# Altium schematic sheet LM61495RPHR_Buck.SchDoc
size A3; SheetNumber: 2; SheetTotal: 3
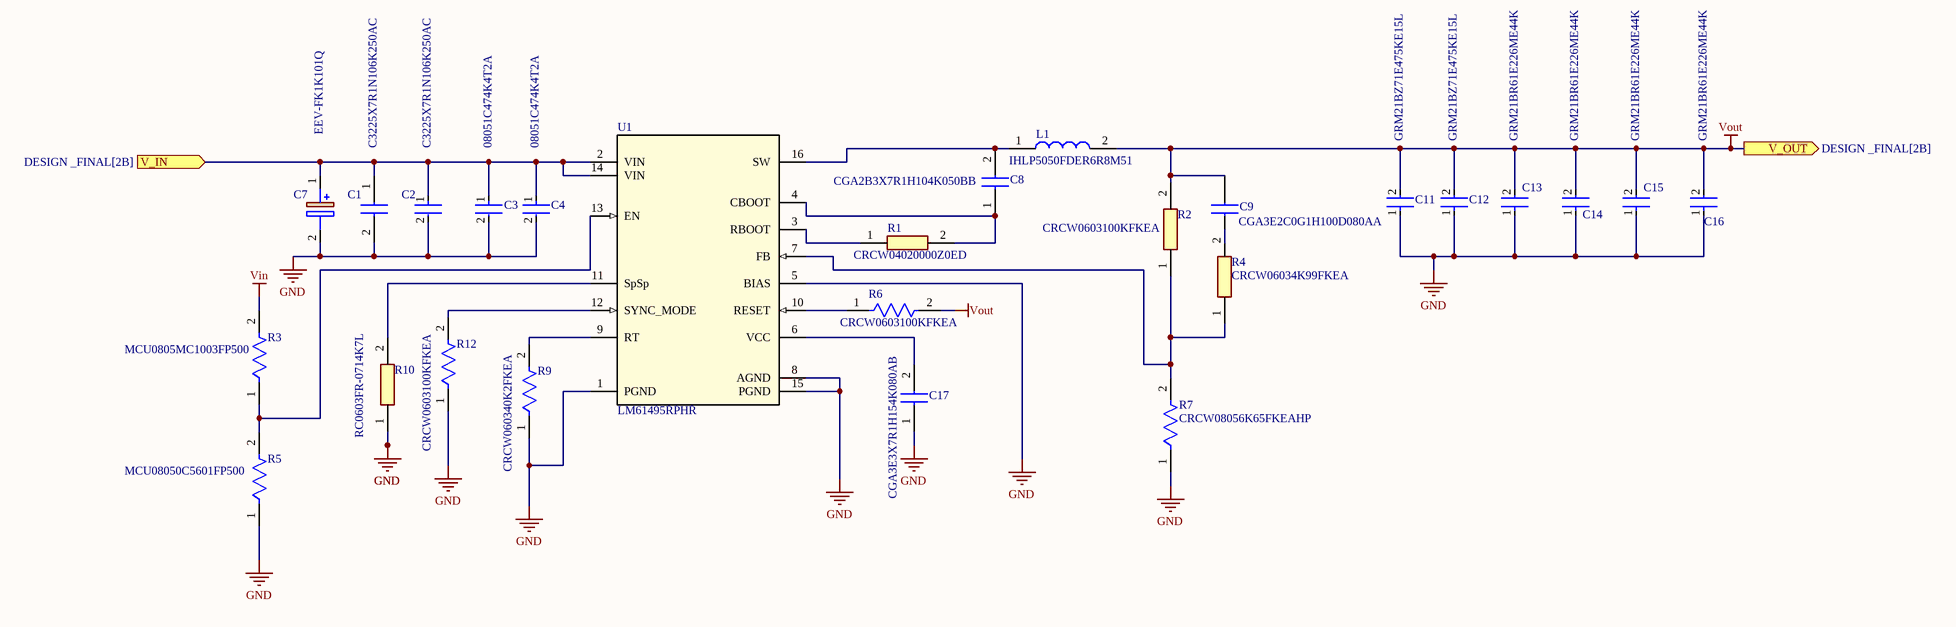
[diagram p0: LM61495RPHR_Buck.SchDoc]

## Parts
C1  C3225X7R1N106K250AC  [CAPC3225X230N]
C2  C3225X7R1N106K250AC  [FP-C3225-250-0_4-IPC_A]
C3  08051C474K4T2A  [FP-0805-L_2_01_0_2-W_1_25-MFG]
C4  08051C474K4T2A  [FP-0805-L_2_01_0_2-W_1_25-MFG]
C7  EEV-FK1K101Q  [EEEFK0J332AQ]
C8  CGA2B3X7R1H104K050BB  [CAPC1005X55N]
C9  CGA3E2C0G1H100D080AA  [CAPC1608X90N]
C11  GRM21BZ71E475KE15L  [FP-GRM21B-0_2-e0_2_0_7-MFG]
C12  GRM21BZ71E475KE15L  [FP-GRM21B-0_2-e0_2_0_7-MFG]
C13  GRM21BR61E226ME44K  [FP-GRM21B-0_2-e0_2_0_7-MFG]
C14  GRM21BR61E226ME44K  [FP-GRM21B-0_2-e0_2_0_7-MFG]
C15  GRM21BR61E226ME44K  [FP-GRM21B-0_2-e0_2_0_7-MFG]
C16  GRM21BR61E226ME44K  [FP-GRM21B-0_2-e0_2_0_7-MFG]
C17  CGA3E3X7R1H154K080AB  [GCM188]
L1  IHLP5050FDER6R8M51  [INDPM135129X640N]
R1  CRCW04020000Z0ED  [RESC1005X40N]
R2  CRCW0603100KFKEA  [RESC1608X50N]
R3  MCU0805MC1003FP500  [FP-MCU0805-IPC_B]
R4  CRCW06034K99FKEA  [RESC1608X50N]
R5  MCU08050C5601FP500  [FP-MCU0805-IPC_B]
R6  CRCW0603100KFKEA  [FP-CRCW0603C-e3-MFG]
R7  CRCW08056K65FKEAHP  [FP-CRCW0805-HPe3-IPC_C]
R9  CRCW060340K2FKEA  [FP-CRCW0603-e3-IPC_B]
R10  RC0603FR-0714K7L  [RESC1608X55N]
R12  CRCW0603100KFKEA  [FP-CRCW0603C-e3-MFG]
U1  LM61495RPHR  [RPH0016A]

## Ports
V_IN (in, see DESIGN _FINAL[2B]), V_OUT (out, see DESIGN _FINAL[2B])

## Nets
GND: C1.2 C2.2 C3.2 C4.2 C7.2(-) C11.1 C12.1 C13.1 C14.1 C15.1 C16.1 C17.1 R5.1 R7.1 R9.1 R10.1 R12.1 U1.1(PGND) U1.5(BIAS) U1.8(AGND) U1.15(PGND)
Vin: R3.2
Vout: C9.2 C11.2 C12.2 C13.2 C14.2 C15.2 C16.2 L1.2 R2.2 R6.2 ; port V_OUT
V_IN: C1.1 C2.1 C3.1 C4.1 C7.1(+) U1.2(VIN) U1.14(VIN) ; port V_IN
NetC8_1: C8.1 R1.2 U1.4(CBOOT)
NetC8_2: C8.2 L1.1 U1.16(SW)
NetC9_1: C9.1 R4.2
NetC17_2: C17.2 U1.6(VCC)
NetR1_1: R1.1 U1.3(RBOOT)
NetR2_1: R2.1 R4.1 R7.2 U1.7(FB)
NetR3_1: R3.1 R5.2 U1.13(EN)
NetR6_1: R6.1 U1.10(RESET)
NetR9_2: R9.2 U1.9(RT)
NetR10_2: R10.2 U1.11(SpSp)
NetR12_2: R12.2 U1.12(SYNC_MODE)

## Library data of the parts
C1 = C3225X7R1N106K250AC: Capacitor; Manufacturer_Name: TDK; Datasheet Link: https://product.tdk.com/info/en/catalog/datasheets/mlcc_commercial_midvoltage_en.pdf; Height: 2.3mm; Manufacturer_Part_Number: C3225X7R1N106K250AC; Mouser Part Number: 810-C3225X7R1N106K25; Mouser Price/Stock: https://www.mouser.co.uk/ProductDetail/TDK/C3225X7R1N106K250AC?qs=P1JMDcb91o5%2Fi%252BA2Vs0UoQ%3D%3D; Arrow Part Number: C3225X7R1N106K250AC; Arrow Price/Stock: https://www.arrow.com/en/products/c3225x7r1n106k250ac/tdk?region=nac
C2 = CMP-08246-003742-1: Multilayer Ceramic Capacitors 10uF ±10% 75V X7R SMD 1210; RoHS Compliant: Yes
C3 C4 = CMP-2007-04773-2: Automotive Ceramic Capacitor, 0805, 470nF, 10%, X7R, 15%, 100V; Packaging: Tape and Reel; Depth: 1.25mm; Voltage Rating (DC): 100V; Length: 2.01mm; Tolerance: 10%; Construction: Flat; Lead Free: Lead Free; Case Code (Metric): 2012; Capacitance: 470nF; Case Code (Imperial): 0805; Max Operating Temperature: 125°C; Dielectric: X7R; Mount: Surface Mount; Min Operating Temperature: -55°C; Voltage Rating: 100V; Radiation Hardening: No; Termination: SMD/SMT; Case/Package: 0805
C7 = EEV-FK1K101Q: Capacitor Polarised; Manufacturer_Name: Panasonic; Datasheet Link: http://industrial.panasonic.com/cdbs/www-data/pdf/RDE0000/ABA0000C1181.pdf; Height: 15mm; Manufacturer_Part_Number: EEV-FK1K101Q; Mouser Part Number: 667-EEV-FK1K101Q; Mouser Price/Stock: https://www.mouser.co.uk/ProductDetail/Panasonic/EEV-FK1K101Q?qs=E4hy2mN5dtmkz2M2wNGN2w%3D%3D; Arrow Part Number: EEV-FK1K101Q; Arrow Price/Stock: https://www.arrow.com/en/products/eev-fk1k101q/panasonic?utm_currency=USD&region=nac
C8 = CGA2B3X7R1H104K050BB: Capacitor; Manufacturer_Name: TDK; Datasheet Link: http://docs-europe.electrocomponents.com/webdocs/14e9/0900766b814e9125.pdf; Height: 0.55mm; Manufacturer_Part_Number: CGA2B3X7R1H104K050BB; Mouser Part Number: 810-CGA2B3X7R1H104K; Mouser Price/Stock: https://www.mouser.co.uk/ProductDetail/TDK/CGA2B3X7R1H104K050BB?qs=NRhsANhppD%252ByZlMHlsweIw%3D%3D; Arrow Part Number: CGA2B3X7R1H104K050BB; Arrow Price/Stock: https://www.arrow.com/en/products/cga2b3x7r1h104k050bb/tdk?region=nac
C9 = CGA3E2C0G1H100D080AA_1: TDK 0603 CGA 10pF Ceramic Multilayer Capacitor, 50 V dc, +125C, C0G Dielectric, +/-0.5pF; Geometry.Height: 0.9mm; Manufacturer_Name: TDK; Manufacturer_Part_Number: CGA3E2C0G1H100D080AA; Mouser Part Number: 810-CGA3E2C0G1H100D; Mouser Price/Stock: https://www.mouser.co.uk/ProductDetail/TDK/CGA3E2C0G1H100D080AA?qs=FxQuwy19cyAWoBWxXEx%2FUg%3D%3D; Arrow Part Number: *; Arrow Price/Stock: *; Datasheet Link: http://docs-europe.electrocomponents.com/webdocs/14e9/0900766b814e9125.pdf
C11 C12 = CMP-06035-039079-1: Chip Multilayer Ceramic Capacitors for General Purpose, 0805, 4.7uF, X7R, 15%, 10%, 25V
C13-C16 = CMP-06035-036790-1: Chip Multilayer Ceramic Capacitors for General Purpose, 0805, 22uF, X5R, 15%, 20%, 25V; Mount: Surface Mount; Voltage Rating: 25V; Capacitance: 22uF; Weight: 0.000335oz; Max Operating Temperature: 85°C; Dielectric: X5R; Length: 0.079inch; Voltage Rating (DC): 25V; Resistor Type: Ceramic; Package Quantity: 10000; Case Code (Imperial): 0805; Tolerance: 20%; Height: 1.25mm; Case/Package: 0805; Case Code (Metric): 2012; Min Operating Temperature: -55°C; Packaging: Tape and Reel; Thickness: 0.057inch; Width: 1.25mm; Termination: SMD/SMT
C17 = GCM188R71C105MA64D: CAP CER 0.15UF 50V X7R 0603; Manufacturer_Name: Murata Electronics; Datasheet Link: https://search.murata.co.jp/Ceramy/image/img/A01X/G101/ENG/GCM188R71C105MA64-04A.pdf; Height: 0.9mm; Manufacturer_Part_Number: GCM188R71C105MA64D; Mouser Part Number: 81-GCM188R71C105MA4D; Mouser Price/Stock: https://www.mouser.com/Search/Refine.aspx?Keyword=81-GCM188R71C105MA4D; Arrow Part Number: GCM188R71C105MA64D; Arrow Price/Stock: https://www.arrow.com/en/products/gcm188r71c105ma64d/murata-manufacturing
L1 = IHLP5050FDER6R8M51: Inductor; Manufacturer_Name: Vishay; Datasheet Link: https://www.mouser.com/datasheet/2/427/ihlp5050fd51-1763968.pdf; Height: 6.4mm; Manufacturer_Part_Number: IHLP5050FDER6R8M51; Mouser Part Number: 70-IHLP5050FDR6R8M51; Mouser Price/Stock: https://www.mouser.co.uk/ProductDetail/Vishay-Dale/IHLP5050FDER6R8M51?qs=tDDpbAIEejpo82ME3ZJqPQ%3D%3D
R1 = CRCW04020000Z0EDHP: Resistor; Manufacturer_Name: Vishay; Datasheet Link: http://www.vishay.com/docs/20035/dcrcwe3.pdf; Height: 0.4mm; Manufacturer_Part_Number: CRCW04020000Z0EDHP; Mouser Part Number: 71-CRCW04020000Z0EDH; Mouser Price/Stock: https://www.mouser.co.uk/ProductDetail/Vishay-Dale/CRCW04020000Z0EDHP?qs=pTGEtN%252BMLlAWtXUIKBil9w%3D%3D; Arrow Part Number: CRCW04020000Z0EDHP; Arrow Price/Stock: https://www.arrow.com/en/products/crcw04020000z0edhp/vishay?utm_currency=USD&region=nac
R2 = CRCW0603100KFKEA: Resistor; Manufacturer_Name: Vishay; Datasheet Link: http://www.vishay.com/docs/20035/dcrcwe3.pdf; Height: 0.5mm; Manufacturer_Part_Number: CRCW0603100KFKEA; Mouser Part Number: 71-CRCW0603-100K-E3; Mouser Price/Stock: https://www.mouser.co.uk/ProductDetail/Vishay-Dale/CRCW0603100KFKEA?qs=6dqgS%252BKntICWHMMdIzt5%2FQ%3D%3D; Arrow Part Number: CRCW0603100KFKEA; Arrow Price/Stock: https://www.arrow.com/en/products/crcw0603100kfkea/vishay?utm_currency=USD&region=nac
R3 = CMP-02407-000323-1: RES 1.05K OHM 0.5% 1/5W 0805; Tolerance: 1%; Resistance: 100kR; Max Operating Temperature: 125°C; Packaging: Tape and Reel; Min Operating Temperature: -55°C; Depth: 1.25mm; Case/Package: 0805; Military Standard: Not; Composition: Thin Film; Length: 2mm
R4 = CRCW06034K99FKEA: Resistor; Manufacturer_Name: Vishay; Datasheet Link: http://www.vishay.com/docs/20035/dcrcwe3.pdf; Height: 0.5mm; Manufacturer_Part_Number: CRCW06034K99FKEA; Mouser Part Number: 71-CRCW0603-4.99K-E3; Mouser Price/Stock: https://www.mouser.co.uk/ProductDetail/Vishay-Dale/CRCW06034K99FKEA?qs=hsLMhf4r0Mayldu5NgAo%2Fg%3D%3D; Arrow Part Number: CRCW06034K99FKEA; Arrow Price/Stock: https://www.arrow.com/en/products/crcw06034k99fkea/vishay?region=nac
R5 = CMP-02407-001419-1: RES 1.05K OHM 0.5% 1/5W 0805; Resistance: 5.6kR; Tolerance: 1%; Temperature Coefficient: 50ppm/°C; Case/Package: 0805; Depth: 1.25mm; Radiation Hardening: No; Military Standard: Not; Packaging: Tape and Reel; Max Operating Temperature: 125°C; Composition: Thin Film; Lead Free: Lead Free; Contact Plating: Tin; Length: 2mm; Min Operating Temperature: -55°C; Width: 1.25mm
R6 R12 = CMP-02407-011574-1: RES SMD 100K OHM 1% 1/10W 0603; Temperature Coefficient: 100ppm/°C; Resistance: 100kR; Power Rating: 100mW; Value: 100kR; Contact Plating: Tin; Length: 1.55mm; Mount: Surface Mount; Min Operating Temperature: -55°C; RoHS Compliant: Yes; Max Operating Temperature: 155°C; Tolerance: 1%; Resistor Type: Thick Film; Termination: Wraparound; Case/Package: Molded; Lead Free: Lead Free
R7 = CMP-02407-011694-1: RES Thick Film, 6.65kΩ, 1%, 0.5W, 100ppm/°C, 0805; Max Power Dissipation: 333mW; Resistance: 6.65kR; Temperature Coefficient: 100ppm/°C; Tolerance: 1%; Package Quantity: 5000; Lead Free: Lead Free; Case/Package: 0805; Length: 0.079inch; Series: CRCW-HP; Number of Terminations: 2; Features: Automotive AEC-Q200; Width: 0.049inch; Resistor Type: Thick Film; RoHS Compliant: Yes; Height: 0.024inch; Packaging: Tape and Reel
R9 = CMP-2000-03336-2: RES Thick Film, 40.2kΩ, 1%, 0.1W, 100ppm/°C, 0603; Voltage Rating (DC): 75V; Power Rating: 100mW; Resistance: 40.2kR; Value: 40.2kR; Packaging: Tape and Reel; Radiation Hardening: No; Lead Free: Lead Free; Contact Plating: Tin; Weight: 7.1E-05oz; Voltage Rating: 75V; Temperature Coefficient: 100ppm/°C; Case Code (Imperial): 0603; Max Operating Temperature: 155°C; Width: 0.85mm; Package Quantity: 5000; Termination: SMD/SMT; Case/Package: 0603; Case Code (Metric): 1608; Depth: 0.85mm; Tolerance: 1%; Composition: Thick Film; Length: 1.55mm; Military Standard: Not; Height: 0.45mm; Min Operating Temperature: -55°C
R10 = RC0603FR-0714K7L: Resistor; Manufacturer_Name: KEMET; Datasheet Link: http://www.yageo.com/documents/recent/PYu-RC0603_51_RoHS_L_v5.pdf; Height: 0.55mm; Manufacturer_Part_Number: RC0603FR-0714K7L; Mouser Part Number: 603-RC0603FR-0714K7L; Mouser Price/Stock: https://www.mouser.co.uk/ProductDetail/YAGEO/RC0603FR-0714K7L?qs=VU8sRB4EgwDFr61Mr4NajA%3D%3D
U1 = LM61495RPHR: 10-A buck converter optimized for power density and low EMI 16-VQFN-HR -40 to 150; Manufacturer_Name: Texas Instruments; TYPE: TYPE; RefDes: RefDes; Copyright: Copyright (C) 2025 Ultra Librarian. All rights reserved.; Manufacturer_Part_Number: LM61495RPHR; Datasheet: https://www.ti.com/lit/gpn/lm61495